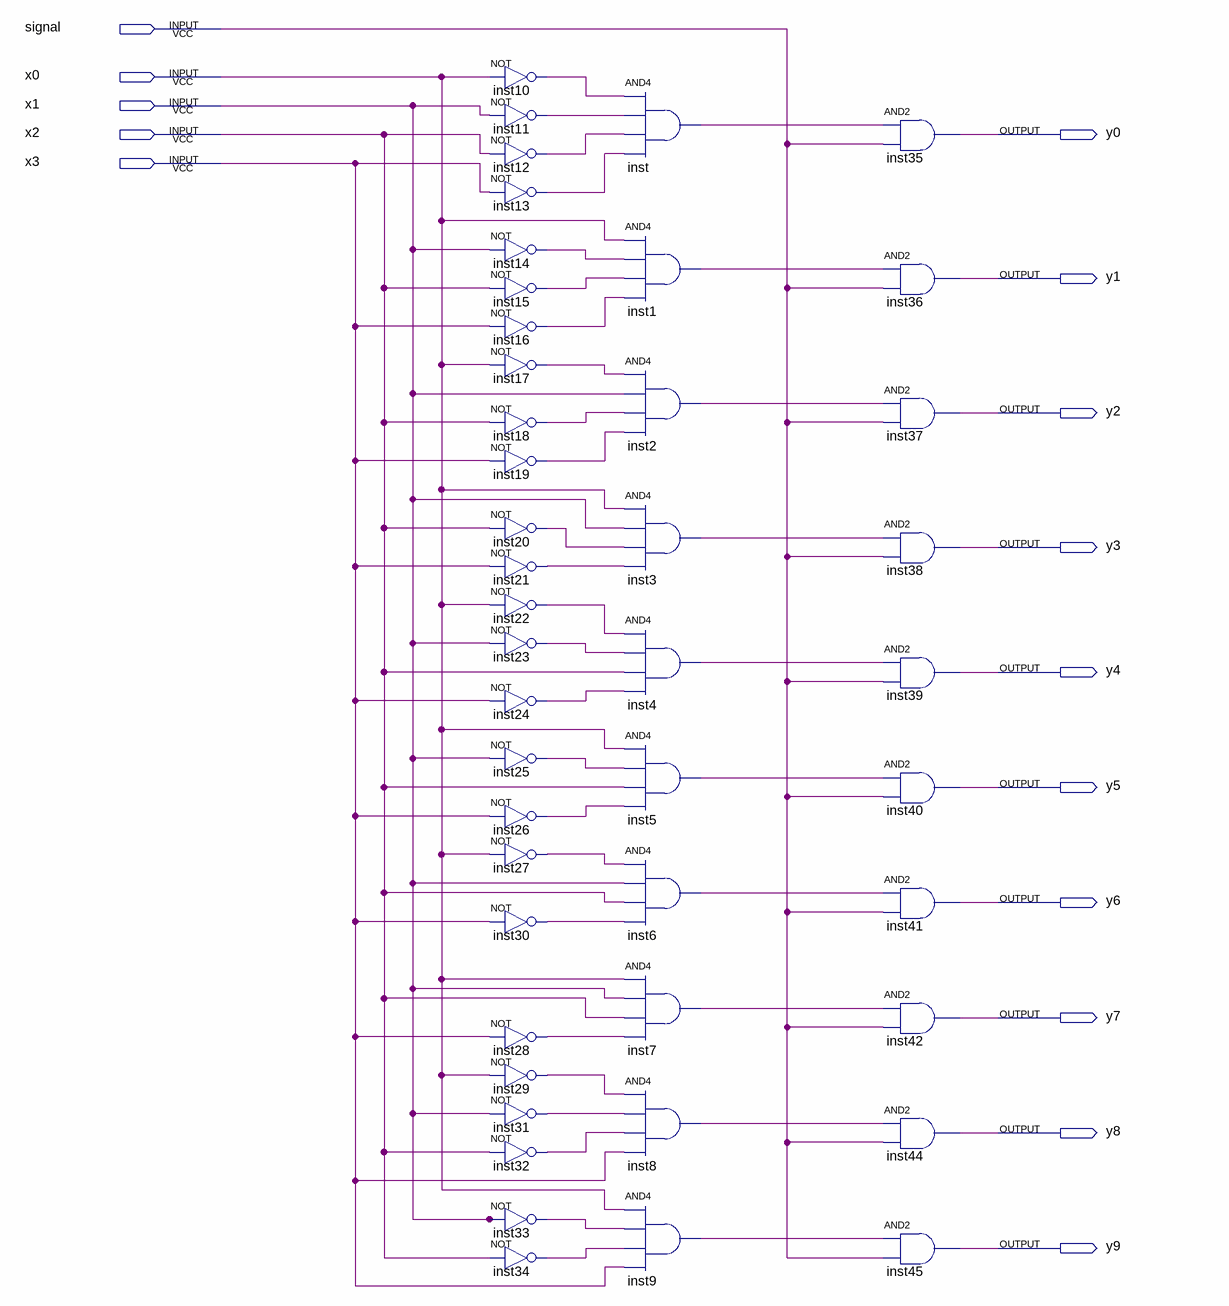
[diagram p0: schematic sheet]
// Quartus schematic mux10.bdf as structural Verilog: 45 symbols, 15 pins
module mux10 (
  input  signal,
  input  x0,
  input  x1,
  input  x2,
  input  x3,
  output y0,
  output y1,
  output y2,
  output y3,
  output y4,
  output y5,
  output y6,
  output y7,
  output y8,
  output y9
);

  wire inst1_out, inst2_out, inst3_out, inst4_out, inst5_out, inst6_out, inst7_out, inst8_out, inst9_out,
       inst10_out, inst11_out, inst12_out, inst13_out, inst14_out, inst15_out, inst16_out, inst17_out,
       inst18_out, inst19_out, inst20_out, inst21_out, inst22_out, inst23_out, inst24_out, inst25_out,
       inst26_out, inst27_out, inst28_out, inst29_out, inst30_out, inst31_out, inst32_out, inst33_out,
       inst34_out, inst_out;

  not inst10 (inst10_out, x0);
  not inst11 (inst11_out, x1);
  not inst12 (inst12_out, x2);
  not inst13 (inst13_out, x3);
  not inst14 (inst14_out, x1);
  not inst15 (inst15_out, x2);
  not inst16 (inst16_out, x3);
  not inst17 (inst17_out, x0);
  not inst18 (inst18_out, x2);
  not inst19 (inst19_out, x3);
  not inst20 (inst20_out, x2);
  not inst21 (inst21_out, x3);
  not inst22 (inst22_out, x0);
  not inst23 (inst23_out, x1);
  not inst24 (inst24_out, x3);
  not inst25 (inst25_out, x1);
  not inst26 (inst26_out, x3);
  not inst27 (inst27_out, x0);
  not inst30 (inst30_out, x3);
  not inst28 (inst28_out, x3);
  not inst29 (inst29_out, x0);
  not inst31 (inst31_out, x1);
  not inst32 (inst32_out, x2);
  not inst33 (inst33_out, x1);
  not inst34 (inst34_out, x2);
  and inst (inst_out, inst10_out, inst11_out, inst12_out, inst13_out);
  and inst1 (inst1_out, x0, inst14_out, inst15_out, inst16_out);
  and inst2 (inst2_out, inst17_out, x1, inst18_out, inst19_out);
  and inst3 (inst3_out, x0, x1, inst20_out, inst21_out);
  and inst4 (inst4_out, inst22_out, inst23_out, x2, inst24_out);
  and inst5 (inst5_out, x0, inst25_out, x2, inst26_out);
  and inst6 (inst6_out, inst27_out, x1, x2, inst30_out);
  and inst7 (inst7_out, x0, x1, x2, inst28_out);
  and inst8 (inst8_out, inst29_out, inst31_out, inst32_out, x3);
  and inst9 (inst9_out, x0, inst33_out, inst34_out, x3);
  and inst35 (y0, inst_out, signal);
  and inst36 (y1, inst1_out, signal);
  and inst37 (y2, inst2_out, signal);
  and inst38 (y3, inst3_out, signal);
  and inst39 (y4, inst4_out, signal);
  and inst40 (y5, inst5_out, signal);
  and inst41 (y6, inst6_out, signal);
  and inst42 (y7, inst7_out, signal);
  and inst44 (y8, inst8_out, signal);
  and inst45 (y9, inst9_out, signal);
endmodule
